# Altium schematic sheet CURRENT_IN.SchDoc
size A4
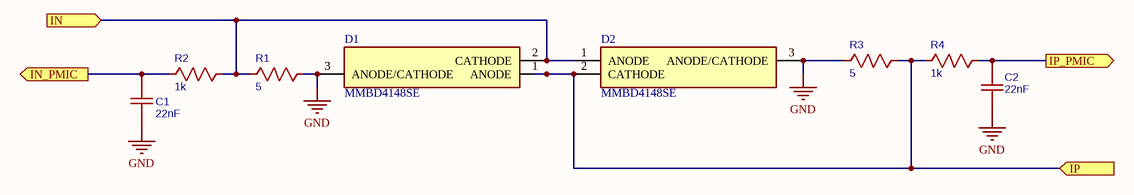
[diagram p0: CURRENT_IN.SchDoc]

## Parts
C1  22nF  [CAPC3216X190]
C2  22nF  [CAPC3216X190]
D1  MMBD4148SE  [SOT95P240X120-3N]
D2  MMBD4148SE  [SOT95P240X120-3N]
R1  5  [RESC3216X75N]
R2  1k  [RESC3216X75N]
R3  5  [RESC3216X75N]
R4  1k  [RESC3216X75N]

## Ports
IN (in), IN_PMIC (out), IP (in), IP_PMIC (out)

## Nets
GND: C1.1 C2.1 D1.3(ANODE/CATHODE) D2.3(ANODE/CATHODE) R1.2 R3.1
IN: D1.2(CATHODE) D2.1(ANODE) R1.1 R2.2 ; port IN
IN_PMIC: C1.2 R2.1 ; port IN_PMIC
IP: D1.1(ANODE) D2.2(CATHODE) R3.2 R4.1 ; port IP
IP_PMIC: C2.2 R4.2 ; port IP_PMIC

## Library data of the parts
C1 C2 = 22nF: nameAlias: Value(F); spicePre: C; spiceSymbolName: Cap_RAD-0.1_US
D1 D2 = MMBD4148SE: Diode; Manufacturer_Name: ON Semiconductor; Datasheet Link: http://www.onsemi.com/pub/Collateral/MMBD4148SE-D.pdf; Height: 1.2mm; Manufacturer_Part_Number: MMBD4148SE; Arrow Part Number: MMBD4148SE; Arrow Price/Stock: https://www.arrow.com/en/products/mmbd4148se/on-semiconductor; Mouser Part Number: 512-MMBD4148SE; Mouser Price/Stock: https://www.mouser.co.uk/ProductDetail/ON-Semiconductor-Fairchild/MMBD4148SE?qs=E58pcOqB2RIih%2Fj%252BJ4dF7g%3D%3D
R1-R4 = 1k: nameAlias: Value(Ω); spicePre: R; spiceSymbolName: Res_AXIAL-0.3(1/8W)_US